# EAGLE schematic COM_R_manufactured (EAGLE 9.7.0)
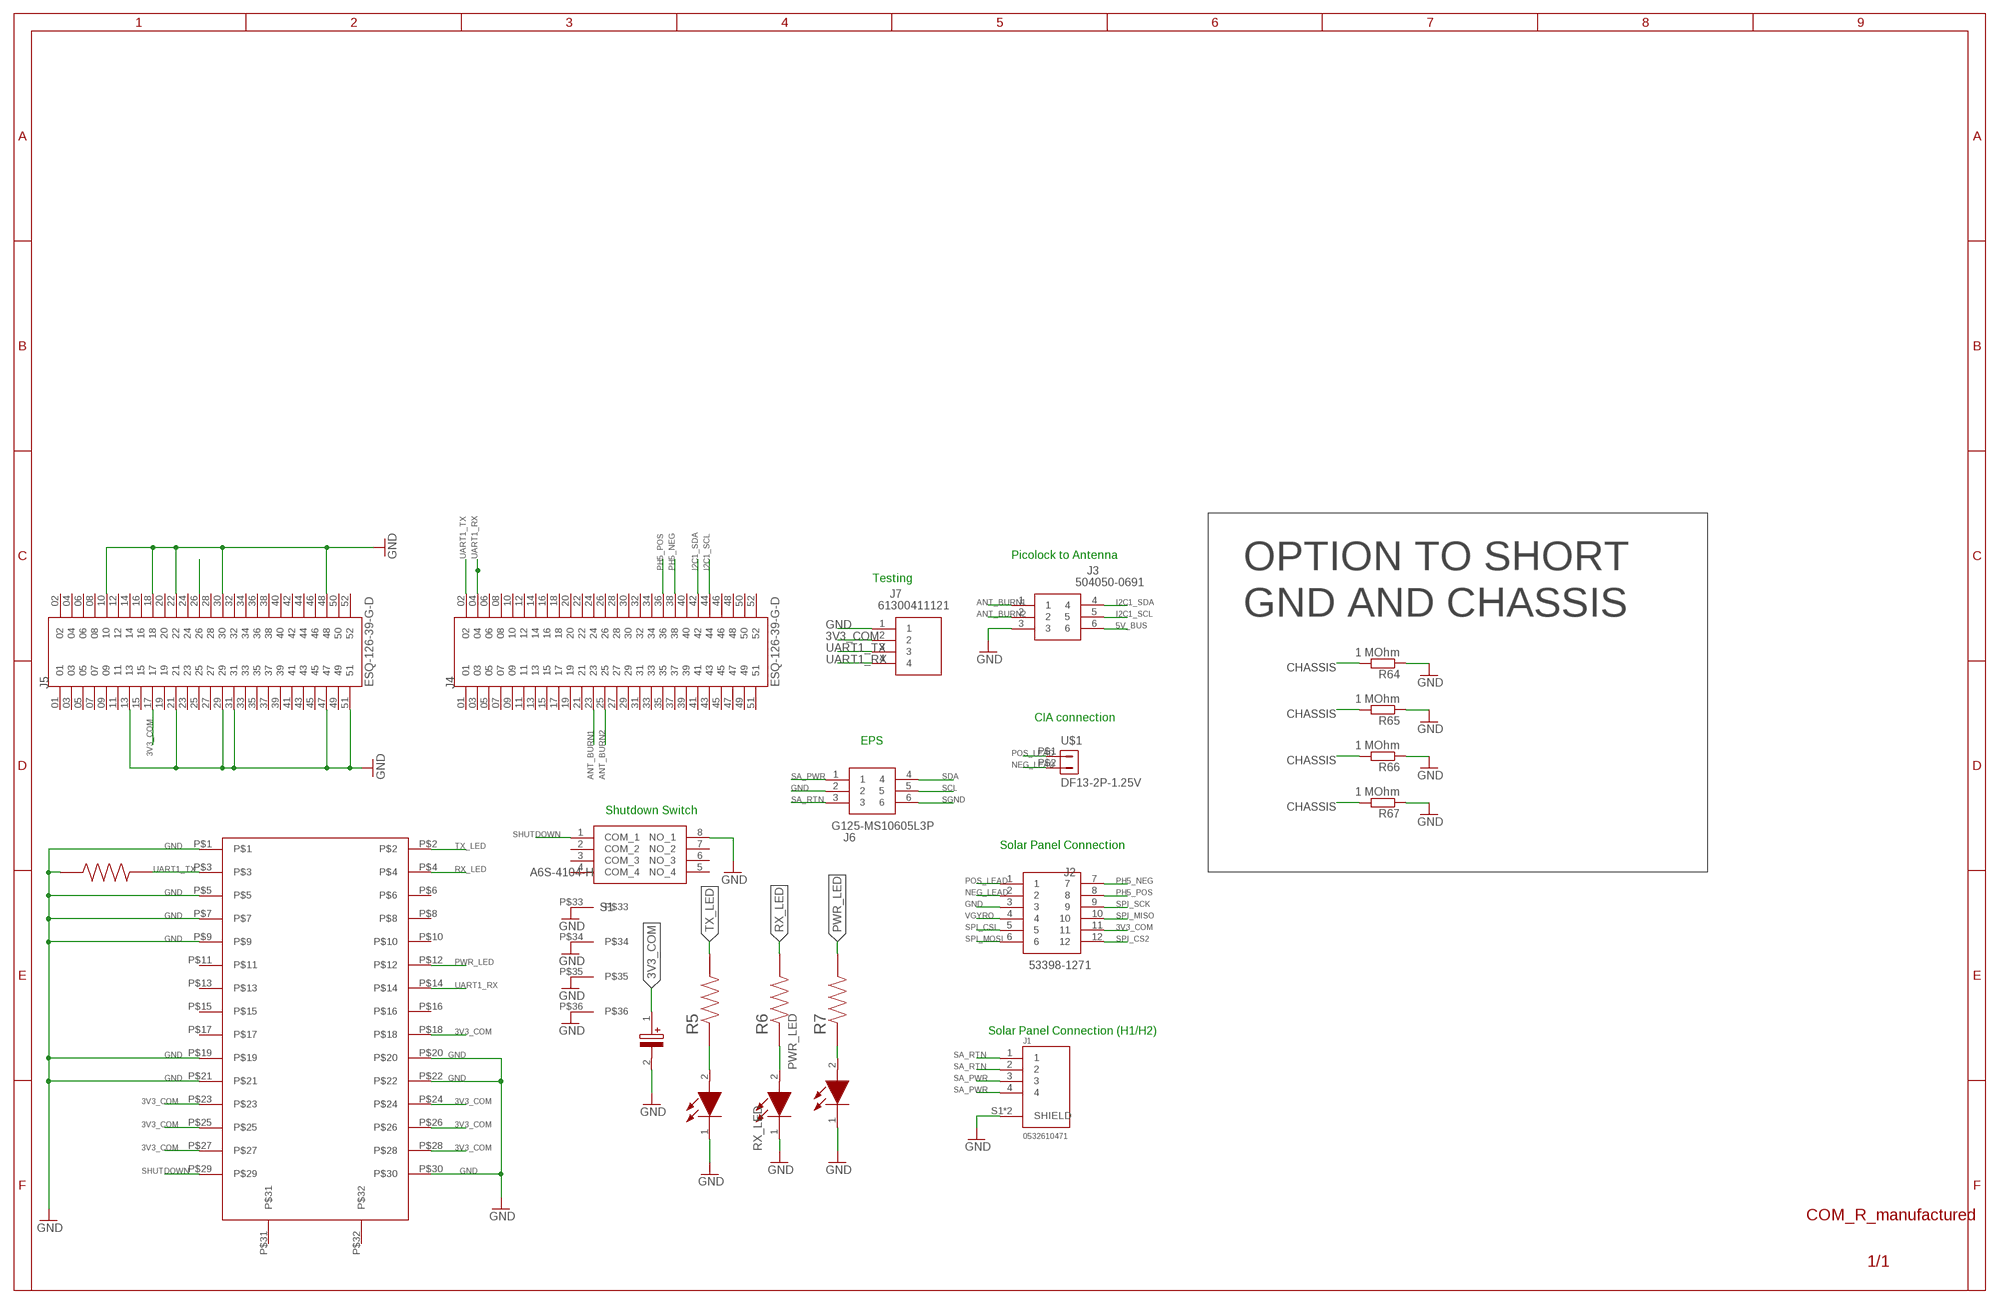
[diagram p0: schematic, sheet 1]
FRAME1 (FRAME_B_L): SPICEPREFIX: X

## Parts
C2  293D106X0010A2TE3  [CAPPM3216X180N]
J1  0532610471  [MOLEX_0532610471]
J2  53398-1271  [53398-1271]
J3  504050-0691  [504050-0691_2]
J4  ESQ-126-39-G-D  [SAMTEC_ESQ-126-39-G-D]
J5  ESQ-126-39-G-D  [SAMTEC_ESQ-126-39-G-D]
J6  G125-MS10605L3P  [G125-MS10605L3P]
J7  61300411121  [HDRV4W95P0X254_1X4_1016X254X85]
PWR_LED  HSMQ-C170-T0000  [LEDC2012X90N]
R3  TNPW080510K0BETY  [RESC2012X55N]
R5  Y40621K00000Q0R  [RESC2012X64N]
R6  Y40621K00000Q0R  [RESC2012X64N]
R7  Y40621K00000Q0R  [RESC2012X64N]
R64  1 MOhm  R-EU_R0805  [R0805]
R65  1 MOhm  R-EU_R0805  [R0805]
R66  1 MOhm  R-EU_R0805  [R0805]
R67  1 MOhm  R-EU_R0805  [R0805]
RX_LED  HSMQ-C170-T0000  [LEDC2012X90N]
S1  A6S-4104-H  [A6S4104H]
TX_LED  HSMQ-C170-T0000  [LEDC2012X90N]
U$1  DF13-2P-1.25V  [DF13C-2P-1.25V]
U$3  XDLRADIOCONNECTORBREAKOUT_KYOCERA_5046_30PIN  [XDLRADIOCONNECTORBREAKOUT_KYOCERA_5046_30PIN]

## Nets
3V3_COM: C2.1(+) J2.11 J5.17 J7.2 U$3.P$18 U$3.P$23 U$3.P$24 U$3.P$25 U$3.P$26 U$3.P$27 U$3.P$28
5V_BUS: J3.6 J5.26
ANT_BURN1: J3.1 J4.23
ANT_BURN2: J3.2 J4.25
CHASSIS: R64.2 R65.2 R66.2 R67.2
GND [New Class]: C2.2(-) J1.S1(SHIELD) J1.S2(SHIELD) J2.3 J3.3 J5.10 J5.13 J5.18 J5.21 J5.22 J5.29 J5.30 J5.31 J5.47 J5.48 J5.51 J6.2 J7.1 PWR_LED.1(K) R3.1 R64.1 R65.1 R66.1 R67.1 RX_LED.1(K) S1.8(NO_1) TX_LED.1(K) U$3.P$1 U$3.P$5 U$3.P$7 U$3.P$9 U$3.P$19 U$3.P$20 U$3.P$21 U$3.P$22 U$3.P$30 U$3.P$33 U$3.P$34 U$3.P$35 U$3.P$36
I2C1_SCL: J3.5 J4.44
I2C1_SDA: J3.4 J4.42
N$1: R5.1 TX_LED.2(A)
N$2: PWR_LED.2(A) R7.1
N$4: R6.1 RX_LED.2(A)
NEG_LEAD: J2.2 U$1.P$2
PH5_NEG: J2.7 J4.38
PH5_POS: J2.8 J4.36
POS_LEAD: J2.1 U$1.P$1
PWR_LED: R7.2 U$3.P$12
RX_LED: R6.2 U$3.P$4
SA_PWR: J1.3 J1.4 J6.1
SA_RTN: J1.1 J1.2 J6.3
SCL: J6.5
SDA: J6.4
SGND: J6.6
SHUTDOWN: S1.1(COM_1) U$3.P$29
SPI_CS2: J2.12
SPI_CSI: J2.5
SPI_MISO: J2.10
SPI_MOSI: J2.6
SPI_SCK: J2.9
TX_LED: R5.2 U$3.P$2
UART1_RX: J4.04 J7.4 U$3.P$14
UART1_TX: J4.02 J7.3 R3.2 U$3.P$3
VGYRO: J2.4
Unconnected: J4.01 J4.03 J4.05 J4.06 J4.07 J4.08 J4.09 J4.10 J4.11 J4.12 J4.13 J4.14 J4.15 J4.16 J4.17 J4.18 J4.19 J4.20 J4.21 J4.22 J4.24 J4.26 J4.27 J4.28 J4.29 J4.30 J4.31 J4.32 J4.33 J4.34 J4.35 J4.37 J4.39 J4.40 J4.41 J4.43 J4.45 J4.46 J4.47 J4.48 J4.49 J4.50 J4.51 J4.52 J5.01 J5.02 J5.03 J5.04 J5.05 J5.06 J5.07 J5.08 J5.09 J5.11 J5.12 J5.14 J5.15 J5.16 J5.19 J5.20 J5.23 J5.24 J5.25 J5.27 J5.28 J5.32 J5.33 J5.34 J5.35 J5.36 J5.37 J5.38 J5.39 J5.40 J5.41 J5.42 J5.43 J5.44 J5.45 J5.46 J5.49 J5.50 J5.52 S1.2(COM_2) S1.3(COM_3) S1.4(COM_4) S1.5(NO_4) S1.6(NO_3) S1.7(NO_2) U$3.P$6 U$3.P$8 U$3.P$10 U$3.P$11 U$3.P$13 U$3.P$15 U$3.P$16 U$3.P$17 U$3.P$31 U$3.P$32

## Notes on the sheet
- Picolock to Antenna
- OPTION TO SHORT
- Testing
- GND AND CHASSIS
- CIA connection
- EPS
- Shutdown Switch
- Solar Panel Connection
- Solar Panel Connection (H1/H2)

## Library data of the parts
C2 = SamacSys_Parts:293D106X0010A2TE3: Solid Tantalum Surface Mount Chip Capacitors TANTAMOUNT(TM), Molded Case, Standard Industrial Grade Source: Datasheet <https://componentsearchengine.com/Datasheets/1/293D106X0010A2TE3.pdf>; DESCRIPTION: Solid Tantalum Surface Mount Chip Capacitors TANTAMOUNT(TM), Molded Case, Standard Industrial Grade; HEIGHT: 1.8mm; MANUFACTURER_NAME: Vishay; MANUFACTURER_PART_NUMBER: 293D106X0010A2TE3; MOUSER_PART_NUMBER: 74-293D106X0010A2TE3; MOUSER_PRICE-STOCK: https://www.mouser.com/Search/Refine.aspx?Keyword=74-293D106X0010A2TE3
J1 = 0532610471:0532610471: Conn Shrouded Header HDR 4 POS 1.25mm Solder RA SMD PicoBlade™ Embossed T/R; AVAILABILITY: Unavailable; DESCRIPTION: Picoblade Connector, 4 Circuit Single Row, Right Angle Surface Mount SMT PCB; DIGIKEY-PURCHASE-URL: https://snapeda.com/shop?store=DigiKey&id=542805; MF: Molex; MP: 0532610471; PACKAGE: None; PRICE: None
J2 = SamacSys_Parts:53398-1271: 12 way SMT straight header Molex PICOBLADE Series, Series Number 53398, 1.25mm Pitch 12 Way 1 Row Shrouded Straight PCB Header, Surface Mount Source: Datasheet <https://componentsearchengine.com/Datasheets/1/53398-1271.pdf>; DESCRIPTION: 12 way SMT straight header Molex PICOBLADE Series, Series Number 53398, 1.25mm Pitch 12 Way 1 Row Shrouded Straight PCB Header, Surface Mount; HEIGHT: mm; MANUFACTURER_NAME: Molex; MANUFACTURER_PART_NUMBER: 53398-1271; MOUSER_PART_NUMBER: 538-53398-1271; MOUSER_PRICE-STOCK: https://www.mouser.com/Search/Refine.aspx?Keyword=538-53398-1271
J3 = SamacSys_Parts:504050-0691: Pico-Lock SMT Wire-to-Board Header 6 way Molex Pico-Lock Series, Series Number 504050, 1.5mm Pitch 6 Way 1 Row Shrouded Right Angle PCB Header, Surface Mount Source: Datasheet <https://componentsearchengine.com/Datasheets/2/504050-0691.pdfhttp://www.molex.com/pdm_docs/sd/5040500691_sd.pdf>; DESCRIPTION: Pico-Lock SMT Wire-to-Board Header 6 way Molex Pico-Lock Series, Series Number 504050, 1.5mm Pitch 6 Way 1 Row Shrouded Right Angle PCB Header, Surface Mount; HEIGHT: mm; MANUFACTURER_NAME: Molex; MANUFACTURER_PART_NUMBER: 504050-0691; MOUSER_PART_NUMBER: 538-504050-0691; MOUSER_PRICE-STOCK: https://www.mouser.co.uk/ProductDetail/Molex/504050-0691?qs=bvCPb%252BE7ys2K1LQC9e%2FvRg%3D%3D
J4 J5 = ESQ-126-39-G-D:ESQ-126-39-G-D; AVAILABILITY: Unavailable; DESCRIPTION: 52 Position Elevated Socket Connector Through Hole; MF: Samtec; MP: ESQ-126-39-G-D; PACKAGE: None; PRICE: None; TOBY_UK-PURCHASE-URL: https://snapeda.com/shop?store=Toby+UK&id=490181
J6 = SamacSys_Parts:G125-MS10605L3P: Gecko DIL Male Vertical Surface Mount Connector, SMT Latches, gold, pick & place (cut tape packing), 6 contacts Source: Datasheet <https://componentsearchengine.com/Datasheets/1/G125-MS10605L3P.pdf>; DESCRIPTION: Gecko DIL Male Vertical Surface Mount Connector, SMT Latches, gold, pick &amp; place (cut tape packing), 6 contacts; HEIGHT: 4.9mm; MANUFACTURER_NAME: Harwin; MANUFACTURER_PART_NUMBER: G125-MS10605L3P; MOUSER_PART_NUMBER: 855-G125-MS10605L3P; MOUSER_PRICE-STOCK: https://www.mouser.com/Search/Refine.aspx?Keyword=855-G125-MS10605L3P
J7 = SamacSys_Parts:61300411121: WR-PHD 2.54mm Pin Header THT Straight 4p Wurth Elektronik WR-PHD Series, Series Number 6130, 2.54mm Pitch 4 Way 1 Row Straight PCB Header, Solder Termination Source: Datasheet <http://katalog.we-online.de/em/datasheet/6130xx11121.pdf>; DESCRIPTION: WR-PHD 2.54mm Pin Header THT Straight 4p Wurth Elektronik WR-PHD Series, Series Number 6130, 2.54mm Pitch 4 Way 1 Row Straight PCB Header, Solder Termination; HEIGHT: 8.54mm; MANUFACTURER_NAME: Wurth Elektronik; MANUFACTURER_PART_NUMBER: 61300411121; MOUSER_PART_NUMBER: 710-61300411121; MOUSER_PRICE-STOCK: https://www.mouser.co.uk/ProductDetail/Wurth-Elektronik/61300411121?qs=PhR8RmCirEYQcLLqXD8rAA%3D%3D
PWR_LED RX_LED TX_LED = SamacSys_Parts:HSMQ-C170-T0000: CHIP,TOP MT,INGAN,GRN - Bulk Source: Datasheet <https://docs.broadcom.com/docs/HSMQ-C170-T0000-DS100>; DESCRIPTION: CHIP,TOP MT,INGAN,GRN - Bulk; HEIGHT: 0.9mm; MANUFACTURER_NAME: Avago Technologies; MANUFACTURER_PART_NUMBER: HSMQ-C170-T0000; MOUSER_PART_NUMBER: 630-HSMQ-C170-T0000; MOUSER_PRICE-STOCK: https://www.mouser.co.uk/ProductDetail/Broadcom-Avago/HSMQ-C170-T0000?qs=Mv7BduZupUglySblHICXPQ%3D%3D
R3 = TNPW080510K0BETY:TNPW080510K0BETY: TNPW, 0805, 10 kOhm, 0.1%, 25 ppm; DESCRIPTION: 10 kOhms ±0.1% 0.125W, 1/8W Chip Resistor 0805 (2012 Metric) Thin Film; DIGI-KEY_PART_NUMBER: 541-3913-1-ND; MF: Vishay; MP: TNPW080510K0BETY; PACKAGE: 2012 Vishay; PURCHASE-URL: https://pricing.snapeda.com/search/part/TNPW080510K0BETY/?ref=eda
R5-R7 = Y40621K00000Q0R:Y40621K00000Q0R; DESCRIPTION: 1 kOhms ±0.02% 0.3W Chip Resistor 0805 (2012 Metric) Moisture Resistant, Non-Inductive Metal Foil; DIGI-KEY_PART_NUMBER: Y4062-1.0KACT-ND; MF: Vishay; MP: Y40621K00000Q0R; PACKAGE: 2012 Vishay; PURCHASE-URL: https://pricing.snapeda.com/search/part/Y40621K00000Q0R/?ref=eda
R64-R67 = rcl:R-EU_: RESISTOR, European symbol; SPICEPREFIX: R
S1 = SamacSys_Parts:A6S-4104-H: 4 Way Surface Mount DIP Switch 4P Source: Datasheet <https://componentsearchengine.com/Datasheets/1/A6S-4104-H.pdf>; DESCRIPTION: 4 Way Surface Mount DIP Switch 4P; HEIGHT: mm; MANUFACTURER_NAME: Omron Electronics; MANUFACTURER_PART_NUMBER: A6S-4104-H; MOUSER_PART_NUMBER: 653-A6S-4104-H; MOUSER_PRICE-STOCK: https://www.mouser.co.uk/ProductDetail/Omron-Electronics/A6S-4104-H?qs=ZP3UR5XsUocSmJ29mwneiw%3D%3D
U$1 = con-hirose-df13:DF13-2P-1.25: DF13-2P 1.25mm Pitch Miniature Crimping Connector.
U$3 = COM_R_SEPT28:XDLRADIOCONNECTORBREAKOUT_KYOCERA_5046_30PIN